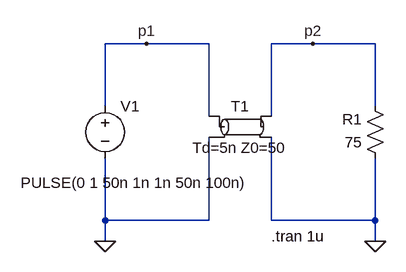
[diagram p0: schematic reflection.asc]
reflection.asc, the LTspice schematic file:
Version 4
SHEET 1 880 680
WIRE 128 128 64 128
WIRE 224 128 128 128
WIRE 384 128 320 128
WIRE 480 128 384 128
WIRE 64 224 64 128
WIRE 480 224 480 128
WIRE 224 240 224 128
WIRE 320 240 320 128
WIRE 64 400 64 304
WIRE 224 400 224 272
WIRE 224 400 64 400
WIRE 320 400 320 272
WIRE 480 400 480 304
WIRE 480 400 320 400
WIRE 64 432 64 400
WIRE 480 432 480 400
FLAG 64 432 0
FLAG 480 432 0
FLAG 128 128 p1
FLAG 384 128 p2
SYMBOL voltage 64 208 R0
WINDOW 3 -130 134 Left 2
SYMATTR Value PULSE(0 1 50n 1n 1n 50n 100n)
SYMATTR InstName V1
SYMBOL tline 272 256 R0
SYMATTR InstName T1
SYMATTR Value Td=5n Z0=50
SYMBOL res 496 320 R180
WINDOW 0 36 76 Left 2
WINDOW 3 36 40 Left 2
SYMATTR InstName R1
SYMATTR Value 75
TEXT 320 424 Left 2 !.tran 1u

The netlist it stands for:
* reflection.asc
V1 p1 0 PULSE(0 1 50n 1n 1n 50n 100n)
T1 p1 0 p2 0 Td=5n Z0=50
R1 0 p2 75
.tran 1u
.backanno
.end